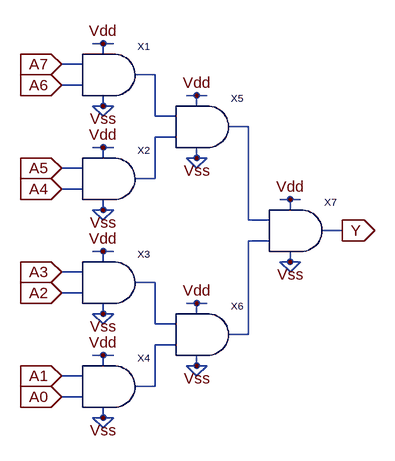
[diagram p0: schematic and8.asc]
and8.asc, the LTspice schematic file:
Version 4
SHEET 1 880 700
WIRE 144 80 128 80
WIRE 160 80 144 80
WIRE 144 96 144 80
WIRE 112 112 80 112
WIRE 224 128 192 128
WIRE 112 144 80 144
WIRE 288 160 272 160
WIRE 304 160 288 160
WIRE 144 176 144 160
WIRE 144 176 128 176
WIRE 160 176 144 176
WIRE 288 176 288 160
WIRE 144 192 128 176
WIRE 144 192 160 176
WIRE 224 192 224 128
WIRE 256 192 224 192
WIRE 368 208 336 208
WIRE 256 224 224 224
WIRE 144 240 128 240
WIRE 160 240 144 240
WIRE 144 256 144 240
WIRE 288 256 288 240
WIRE 288 256 272 256
WIRE 304 256 288 256
WIRE 112 272 80 272
WIRE 288 272 272 256
WIRE 288 272 304 256
WIRE 224 288 224 224
WIRE 224 288 192 288
WIRE 112 304 80 304
WIRE 432 320 416 320
WIRE 448 320 432 320
WIRE 144 336 144 320
WIRE 144 336 128 336
WIRE 160 336 144 336
WIRE 432 336 432 320
WIRE 144 352 128 336
WIRE 144 352 160 336
WIRE 368 352 368 208
WIRE 400 352 368 352
WIRE 512 368 480 368
WIRE 400 384 368 384
WIRE 144 400 128 400
WIRE 160 400 144 400
WIRE 144 416 144 400
WIRE 432 416 432 400
WIRE 432 416 416 416
WIRE 448 416 432 416
WIRE 112 432 80 432
WIRE 432 432 416 416
WIRE 432 432 448 416
WIRE 224 448 192 448
WIRE 112 464 80 464
WIRE 288 480 272 480
WIRE 304 480 288 480
WIRE 144 496 144 480
WIRE 144 496 128 496
WIRE 160 496 144 496
WIRE 288 496 288 480
WIRE 144 512 128 496
WIRE 144 512 160 496
WIRE 224 512 224 448
WIRE 256 512 224 512
WIRE 368 528 368 384
WIRE 368 528 336 528
WIRE 256 544 224 544
WIRE 144 560 128 560
WIRE 160 560 144 560
WIRE 144 576 144 560
WIRE 288 576 288 560
WIRE 288 576 272 576
WIRE 304 576 288 576
WIRE 112 592 80 592
WIRE 288 592 272 576
WIRE 288 592 304 576
WIRE 224 608 224 544
WIRE 224 608 192 608
WIRE 112 624 80 624
WIRE 144 656 144 640
WIRE 144 656 128 656
WIRE 160 656 144 656
WIRE 144 672 128 656
WIRE 144 672 160 656
FLAG 144 80 Vdd
FLAG 144 176 Vss
FLAG 144 240 Vdd
FLAG 144 336 Vss
FLAG 144 400 Vdd
FLAG 144 496 Vss
FLAG 144 560 Vdd
FLAG 144 656 Vss
FLAG 288 160 Vdd
FLAG 288 256 Vss
FLAG 288 480 Vdd
FLAG 288 576 Vss
FLAG 432 320 Vdd
FLAG 432 416 Vss
FLAG 80 624 A0
IOPIN 80 624 In
FLAG 80 592 A1
IOPIN 80 592 In
FLAG 80 464 A2
IOPIN 80 464 In
FLAG 80 432 A3
IOPIN 80 432 In
FLAG 80 304 A4
IOPIN 80 304 In
FLAG 80 272 A5
IOPIN 80 272 In
FLAG 80 144 A6
IOPIN 80 144 In
FLAG 80 112 A7
IOPIN 80 112 In
FLAG 512 368 Y
IOPIN 512 368 Out
SYMBOL and 112 128 R0
SYMATTR InstName X1
SYMBOL and 112 288 R0
SYMATTR InstName X2
SYMBOL and 112 448 R0
SYMATTR InstName X3
SYMBOL and 112 608 R0
SYMATTR InstName X4
SYMBOL and 256 208 R0
SYMATTR InstName X5
SYMBOL and 256 528 R0
SYMATTR InstName X6
SYMBOL and 400 368 R0
SYMATTR InstName X7

The netlist it stands for:
* and8.asc
XX1 A7 A6 N001 Vdd Vss and  ; pins A B Y Vdd Vss
XX2 A5 A4 N003 Vdd Vss and  ; pins A B Y Vdd Vss
XX3 A3 A2 N005 Vdd Vss and  ; pins A B Y Vdd Vss
XX4 A1 A0 N006 Vdd Vss and  ; pins A B Y Vdd Vss
XX5 N001 N003 N002 Vdd Vss and  ; pins A B Y Vdd Vss
XX6 N005 N006 N004 Vdd Vss and  ; pins A B Y Vdd Vss
XX7 N002 N004 Y Vdd Vss and  ; pins A B Y Vdd Vss
.backanno
.end